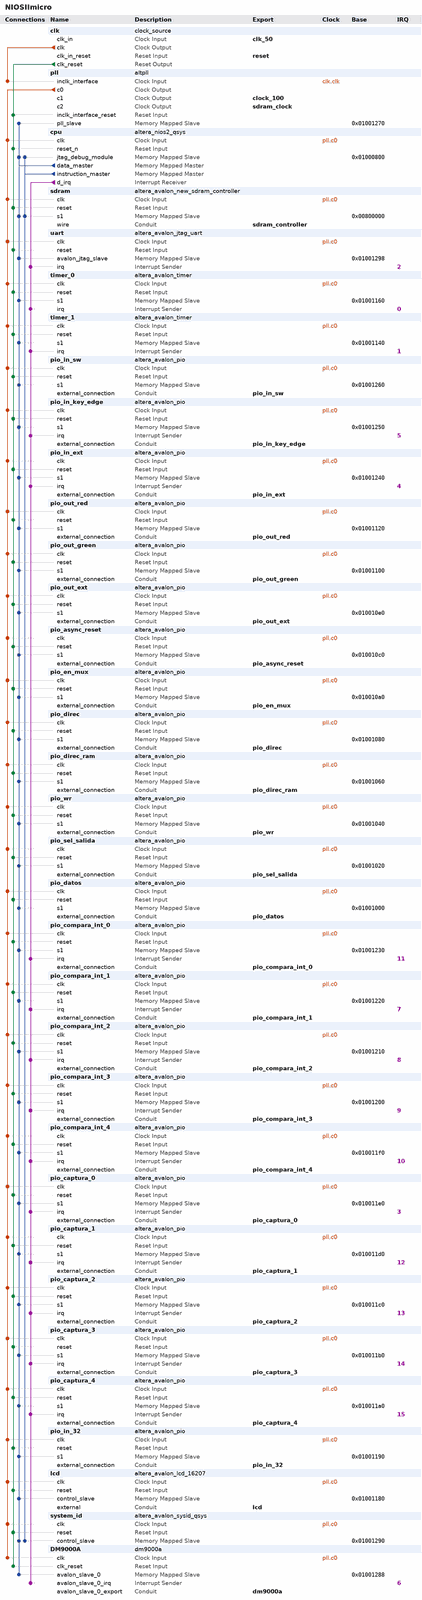
[diagram p0: system contents, whole]
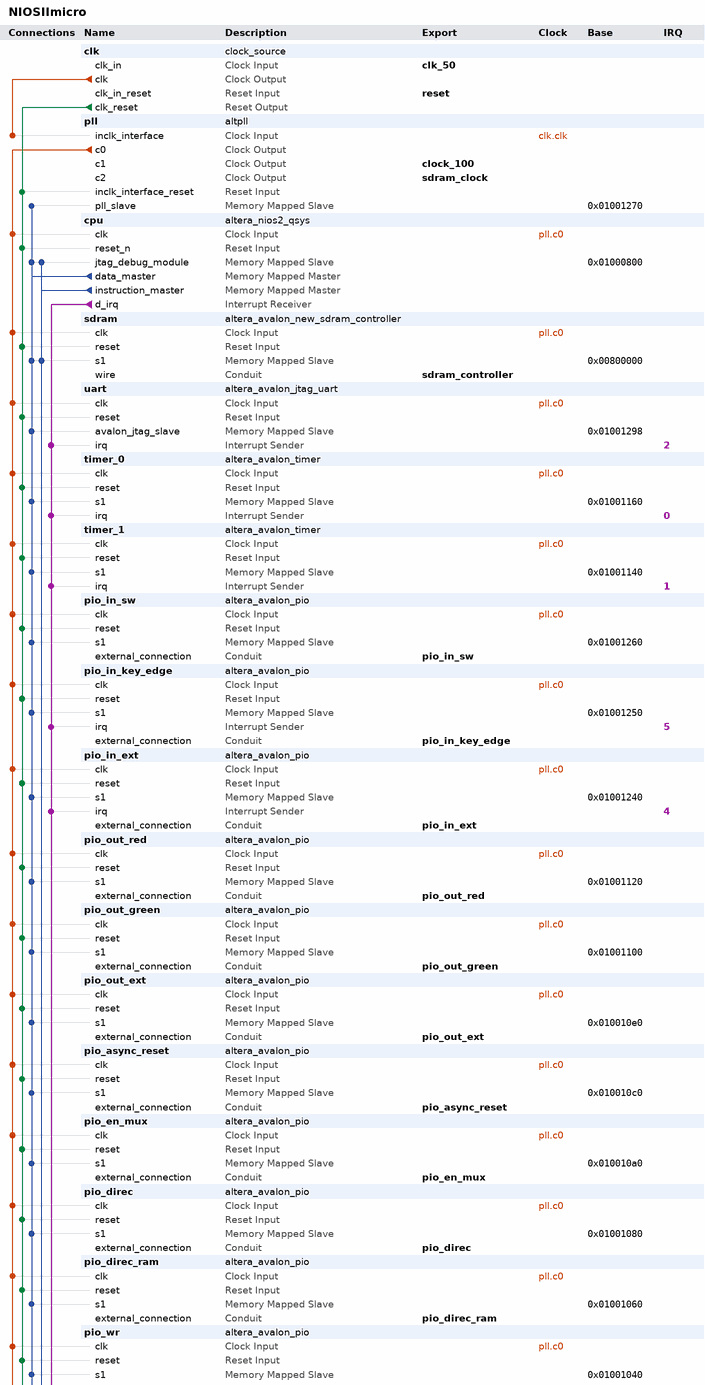
[diagram p1: system contents, upper part]
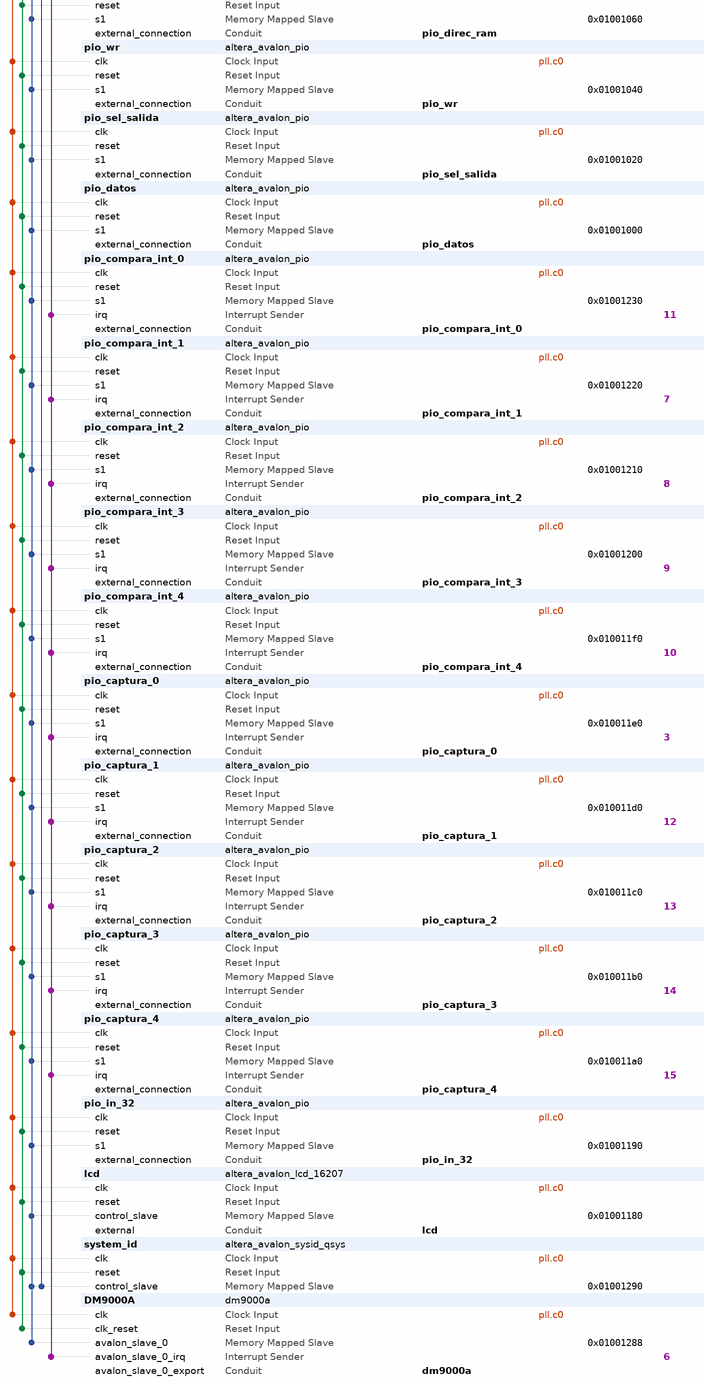
[diagram p2: system contents, lower part]
# Platform Designer (Qsys) system NIOSIImicro, Cyclone II EP2C35F672C6
# Parameters at their usual value, and those the tool derives, are not listed.
package require -exact qsys 13.0.1.99.2
create_system NIOSIImicro
set_project_property DEVICE_FAMILY {Cyclone II}
set_project_property DEVICE EP2C35F672C6

add_instance clk clock_source 13.0
set_instance_parameter_value clk clockFrequency 50000000

add_instance pll altpll 13.0
set_instance_parameter_value pll INCLK0_INPUT_FREQUENCY 20000
set_instance_parameter_value pll GATE_LOCK_SIGNAL NO
set_instance_parameter_value pll VALID_LOCK_MULTIPLIER 1
set_instance_parameter_value pll INVALID_LOCK_MULTIPLIER 5
set_instance_parameter_value pll CLK0_MULTIPLY_BY 1
set_instance_parameter_value pll CLK1_MULTIPLY_BY 2
set_instance_parameter_value pll CLK2_MULTIPLY_BY 1
set_instance_parameter_value pll CLK0_DIVIDE_BY 1
set_instance_parameter_value pll CLK1_DIVIDE_BY 1
set_instance_parameter_value pll CLK2_DIVIDE_BY 1
set_instance_parameter_value pll CLK1_PHASE_SHIFT 0
set_instance_parameter_value pll CLK2_PHASE_SHIFT -3000
set_instance_parameter_value pll CLK1_DUTY_CYCLE 50
set_instance_parameter_value pll CLK2_DUTY_CYCLE 50
set_instance_parameter_value pll PORT_clk1 PORT_USED
set_instance_parameter_value pll PORT_clk2 PORT_USED
set_instance_parameter_value pll PORT_clk3 PORT_UNUSED
set_instance_parameter_value pll PORT_ARESET PORT_UNUSED
set_instance_parameter_value pll PORT_LOCKED PORT_UNUSED

add_instance cpu altera_nios2_qsys 13.0
set_instance_parameter_value cpu manuallyAssignCpuID false
set_instance_parameter_value cpu resetSlave sdram.s1
set_instance_parameter_value cpu mmu_TLBMissExcSlave None
set_instance_parameter_value cpu exceptionSlave sdram.s1
set_instance_parameter_value cpu breakSlave cpu.jtag_debug_module
set_instance_parameter_value cpu impl Fast
set_instance_parameter_value cpu icache_size 4096
set_instance_parameter_value cpu dcache_lineSize 4

add_instance sdram altera_avalon_new_sdram_controller 13.0.1.99.2
set_instance_parameter_value sdram TAC 5.5
set_instance_parameter_value sdram TRCD 20.0
set_instance_parameter_value sdram TRP 20.0
set_instance_parameter_value sdram casLatency 3
set_instance_parameter_value sdram columnWidth 8
set_instance_parameter_value sdram dataWidth 16
set_instance_parameter_value sdram generateSimulationModel false
set_instance_parameter_value sdram model single_Micron_MT48LC4M32B2_7_chip
set_instance_parameter_value sdram numberOfBanks 4
set_instance_parameter_value sdram numberOfChipSelects 1
set_instance_parameter_value sdram powerUpDelay 100.0
set_instance_parameter_value sdram refreshPeriod 15.625
set_instance_parameter_value sdram rowWidth 12

add_instance uart altera_avalon_jtag_uart 13.0.1.99.2
set_instance_parameter_value uart simInteractiveOptions NO_INTERACTIVE_WINDOWS

add_instance timer_0 altera_avalon_timer 13.0.1.99.2
set_instance_parameter_value timer_0 period 100
set_instance_parameter_value timer_0 periodUnits USEC

add_instance timer_1 altera_avalon_timer 13.0.1.99.2
set_instance_parameter_value timer_1 period 1
set_instance_parameter_value timer_1 periodUnits MSEC

add_instance pio_in_sw altera_avalon_pio 13.0.1.99.2
set_instance_parameter_value pio_in_sw direction Input
set_instance_parameter_value pio_in_sw width 18

add_instance pio_in_key_edge altera_avalon_pio 13.0.1.99.2
set_instance_parameter_value pio_in_key_edge bitClearingEdgeCapReg true
set_instance_parameter_value pio_in_key_edge captureEdge true
set_instance_parameter_value pio_in_key_edge direction Input
set_instance_parameter_value pio_in_key_edge edgeType FALLING
set_instance_parameter_value pio_in_key_edge generateIRQ true
set_instance_parameter_value pio_in_key_edge irqType EDGE
set_instance_parameter_value pio_in_key_edge width 3

add_instance pio_in_ext altera_avalon_pio 13.0.1.99.2
set_instance_parameter_value pio_in_ext bitClearingEdgeCapReg true
set_instance_parameter_value pio_in_ext captureEdge true
set_instance_parameter_value pio_in_ext direction Input
set_instance_parameter_value pio_in_ext generateIRQ true
set_instance_parameter_value pio_in_ext irqType EDGE
set_instance_parameter_value pio_in_ext width 8

add_instance pio_out_red altera_avalon_pio 13.0.1.99.2
set_instance_parameter_value pio_out_red bitModifyingOutReg true
set_instance_parameter_value pio_out_red direction Output
set_instance_parameter_value pio_out_red width 18

add_instance pio_out_green altera_avalon_pio 13.0.1.99.2
set_instance_parameter_value pio_out_green bitModifyingOutReg true
set_instance_parameter_value pio_out_green direction Output
set_instance_parameter_value pio_out_green width 9

add_instance pio_out_ext altera_avalon_pio 13.0.1.99.2
set_instance_parameter_value pio_out_ext bitModifyingOutReg true
set_instance_parameter_value pio_out_ext direction Output
set_instance_parameter_value pio_out_ext width 8

add_instance pio_async_reset altera_avalon_pio 13.0.1.99.2
set_instance_parameter_value pio_async_reset bitModifyingOutReg true
set_instance_parameter_value pio_async_reset direction Output
set_instance_parameter_value pio_async_reset width 1

add_instance pio_en_mux altera_avalon_pio 13.0.1.99.2
set_instance_parameter_value pio_en_mux bitModifyingOutReg true
set_instance_parameter_value pio_en_mux direction Output
set_instance_parameter_value pio_en_mux width 1

add_instance pio_direc altera_avalon_pio 13.0.1.99.2
set_instance_parameter_value pio_direc bitModifyingOutReg true
set_instance_parameter_value pio_direc direction Output
set_instance_parameter_value pio_direc width 4

add_instance pio_direc_ram altera_avalon_pio 13.0.1.99.2
set_instance_parameter_value pio_direc_ram bitModifyingOutReg true
set_instance_parameter_value pio_direc_ram direction Output
set_instance_parameter_value pio_direc_ram width 6

add_instance pio_wr altera_avalon_pio 13.0.1.99.2
set_instance_parameter_value pio_wr bitModifyingOutReg true
set_instance_parameter_value pio_wr direction Output
set_instance_parameter_value pio_wr width 1

add_instance pio_sel_salida altera_avalon_pio 13.0.1.99.2
set_instance_parameter_value pio_sel_salida bitModifyingOutReg true
set_instance_parameter_value pio_sel_salida direction Output
set_instance_parameter_value pio_sel_salida width 4

add_instance pio_datos altera_avalon_pio 13.0.1.99.2
set_instance_parameter_value pio_datos bitModifyingOutReg true
set_instance_parameter_value pio_datos direction Output
set_instance_parameter_value pio_datos width 32

add_instance pio_compara_int_0 altera_avalon_pio 13.0.1.99.2
set_instance_parameter_value pio_compara_int_0 bitClearingEdgeCapReg true
set_instance_parameter_value pio_compara_int_0 captureEdge true
set_instance_parameter_value pio_compara_int_0 direction Input
set_instance_parameter_value pio_compara_int_0 generateIRQ true
set_instance_parameter_value pio_compara_int_0 irqType EDGE
set_instance_parameter_value pio_compara_int_0 width 1

add_instance pio_compara_int_1 altera_avalon_pio 13.0.1.99.2
set_instance_parameter_value pio_compara_int_1 bitClearingEdgeCapReg true
set_instance_parameter_value pio_compara_int_1 captureEdge true
set_instance_parameter_value pio_compara_int_1 direction Input
set_instance_parameter_value pio_compara_int_1 generateIRQ true
set_instance_parameter_value pio_compara_int_1 irqType EDGE
set_instance_parameter_value pio_compara_int_1 width 1

add_instance pio_compara_int_2 altera_avalon_pio 13.0.1.99.2
set_instance_parameter_value pio_compara_int_2 bitClearingEdgeCapReg true
set_instance_parameter_value pio_compara_int_2 captureEdge true
set_instance_parameter_value pio_compara_int_2 direction Input
set_instance_parameter_value pio_compara_int_2 generateIRQ true
set_instance_parameter_value pio_compara_int_2 irqType EDGE
set_instance_parameter_value pio_compara_int_2 width 1

add_instance pio_compara_int_3 altera_avalon_pio 13.0.1.99.2
set_instance_parameter_value pio_compara_int_3 bitClearingEdgeCapReg true
set_instance_parameter_value pio_compara_int_3 captureEdge true
set_instance_parameter_value pio_compara_int_3 direction Input
set_instance_parameter_value pio_compara_int_3 generateIRQ true
set_instance_parameter_value pio_compara_int_3 irqType EDGE
set_instance_parameter_value pio_compara_int_3 width 1

add_instance pio_compara_int_4 altera_avalon_pio 13.0.1.99.2
set_instance_parameter_value pio_compara_int_4 bitClearingEdgeCapReg true
set_instance_parameter_value pio_compara_int_4 captureEdge true
set_instance_parameter_value pio_compara_int_4 direction Input
set_instance_parameter_value pio_compara_int_4 generateIRQ true
set_instance_parameter_value pio_compara_int_4 irqType EDGE
set_instance_parameter_value pio_compara_int_4 width 1

add_instance pio_captura_0 altera_avalon_pio 13.0.1.99.2
set_instance_parameter_value pio_captura_0 bitClearingEdgeCapReg true
set_instance_parameter_value pio_captura_0 captureEdge true
set_instance_parameter_value pio_captura_0 direction Input
set_instance_parameter_value pio_captura_0 generateIRQ true
set_instance_parameter_value pio_captura_0 irqType EDGE
set_instance_parameter_value pio_captura_0 width 1

add_instance pio_captura_1 altera_avalon_pio 13.0.1.99.2
set_instance_parameter_value pio_captura_1 bitClearingEdgeCapReg true
set_instance_parameter_value pio_captura_1 captureEdge true
set_instance_parameter_value pio_captura_1 direction Input
set_instance_parameter_value pio_captura_1 generateIRQ true
set_instance_parameter_value pio_captura_1 irqType EDGE
set_instance_parameter_value pio_captura_1 width 1

add_instance pio_captura_2 altera_avalon_pio 13.0.1.99.2
set_instance_parameter_value pio_captura_2 bitClearingEdgeCapReg true
set_instance_parameter_value pio_captura_2 captureEdge true
set_instance_parameter_value pio_captura_2 direction Input
set_instance_parameter_value pio_captura_2 generateIRQ true
set_instance_parameter_value pio_captura_2 irqType EDGE
set_instance_parameter_value pio_captura_2 width 1

add_instance pio_captura_3 altera_avalon_pio 13.0.1.99.2
set_instance_parameter_value pio_captura_3 bitClearingEdgeCapReg true
set_instance_parameter_value pio_captura_3 captureEdge true
set_instance_parameter_value pio_captura_3 direction Input
set_instance_parameter_value pio_captura_3 generateIRQ true
set_instance_parameter_value pio_captura_3 irqType EDGE
set_instance_parameter_value pio_captura_3 width 1

add_instance pio_captura_4 altera_avalon_pio 13.0.1.99.2
set_instance_parameter_value pio_captura_4 bitClearingEdgeCapReg true
set_instance_parameter_value pio_captura_4 captureEdge true
set_instance_parameter_value pio_captura_4 direction Input
set_instance_parameter_value pio_captura_4 generateIRQ true
set_instance_parameter_value pio_captura_4 irqType EDGE
set_instance_parameter_value pio_captura_4 width 1

add_instance pio_in_32 altera_avalon_pio 13.0.1.99.2
set_instance_parameter_value pio_in_32 bitClearingEdgeCapReg true
set_instance_parameter_value pio_in_32 captureEdge true
set_instance_parameter_value pio_in_32 direction Input
set_instance_parameter_value pio_in_32 width 32

add_instance lcd altera_avalon_lcd_16207 13.0.1.99.2

add_instance system_id altera_avalon_sysid_qsys 13.0
set_instance_parameter_value system_id id 305419896

add_instance DM9000A dm9000a 1.0.1

# connections
add_connection clk.clk pll.inclk_interface clock
add_connection pll.c0 cpu.clk clock
add_connection pll.c0 DM9000A.clk clock
add_connection pll.c0 lcd.clk clock
add_connection pll.c0 pio_async_reset.clk clock
add_connection pll.c0 pio_captura_0.clk clock
add_connection pll.c0 pio_captura_1.clk clock
add_connection pll.c0 pio_captura_2.clk clock
add_connection pll.c0 pio_captura_3.clk clock
add_connection pll.c0 pio_captura_4.clk clock
add_connection pll.c0 pio_compara_int_0.clk clock
add_connection pll.c0 pio_compara_int_1.clk clock
add_connection pll.c0 pio_compara_int_2.clk clock
add_connection pll.c0 pio_compara_int_3.clk clock
add_connection pll.c0 pio_compara_int_4.clk clock
add_connection pll.c0 pio_datos.clk clock
add_connection pll.c0 pio_direc.clk clock
add_connection pll.c0 pio_direc_ram.clk clock
add_connection pll.c0 pio_en_mux.clk clock
add_connection pll.c0 pio_in_32.clk clock
add_connection pll.c0 pio_in_ext.clk clock
add_connection pll.c0 pio_in_key_edge.clk clock
add_connection pll.c0 pio_in_sw.clk clock
add_connection pll.c0 pio_out_ext.clk clock
add_connection pll.c0 pio_out_green.clk clock
add_connection pll.c0 pio_out_red.clk clock
add_connection pll.c0 pio_sel_salida.clk clock
add_connection pll.c0 pio_wr.clk clock
add_connection pll.c0 sdram.clk clock
add_connection pll.c0 system_id.clk clock
add_connection pll.c0 timer_0.clk clock
add_connection pll.c0 timer_1.clk clock
add_connection pll.c0 uart.clk clock
add_connection clk.clk_reset cpu.reset_n reset
add_connection clk.clk_reset DM9000A.clk_reset reset
add_connection clk.clk_reset lcd.reset reset
add_connection clk.clk_reset pio_async_reset.reset reset
add_connection clk.clk_reset pio_captura_0.reset reset
add_connection clk.clk_reset pio_captura_1.reset reset
add_connection clk.clk_reset pio_captura_2.reset reset
add_connection clk.clk_reset pio_captura_3.reset reset
add_connection clk.clk_reset pio_captura_4.reset reset
add_connection clk.clk_reset pio_compara_int_0.reset reset
add_connection clk.clk_reset pio_compara_int_1.reset reset
add_connection clk.clk_reset pio_compara_int_2.reset reset
add_connection clk.clk_reset pio_compara_int_3.reset reset
add_connection clk.clk_reset pio_compara_int_4.reset reset
add_connection clk.clk_reset pio_datos.reset reset
add_connection clk.clk_reset pio_direc.reset reset
add_connection clk.clk_reset pio_direc_ram.reset reset
add_connection clk.clk_reset pio_en_mux.reset reset
add_connection clk.clk_reset pio_in_32.reset reset
add_connection clk.clk_reset pio_in_ext.reset reset
add_connection clk.clk_reset pio_in_key_edge.reset reset
add_connection clk.clk_reset pio_in_sw.reset reset
add_connection clk.clk_reset pio_out_ext.reset reset
add_connection clk.clk_reset pio_out_green.reset reset
add_connection clk.clk_reset pio_out_red.reset reset
add_connection clk.clk_reset pio_sel_salida.reset reset
add_connection clk.clk_reset pio_wr.reset reset
add_connection clk.clk_reset pll.inclk_interface_reset reset
add_connection clk.clk_reset sdram.reset reset
add_connection clk.clk_reset system_id.reset reset
add_connection clk.clk_reset timer_0.reset reset
add_connection clk.clk_reset timer_1.reset reset
add_connection clk.clk_reset uart.reset reset
add_connection cpu.data_master cpu.jtag_debug_module avalon
set_connection_parameter_value cpu.data_master/cpu.jtag_debug_module baseAddress 0x01000800
add_connection cpu.data_master DM9000A.avalon_slave_0 avalon
set_connection_parameter_value cpu.data_master/DM9000A.avalon_slave_0 baseAddress 0x01001288
add_connection cpu.data_master lcd.control_slave avalon
set_connection_parameter_value cpu.data_master/lcd.control_slave baseAddress 0x01001180
add_connection cpu.data_master pio_async_reset.s1 avalon
set_connection_parameter_value cpu.data_master/pio_async_reset.s1 baseAddress 0x010010c0
add_connection cpu.data_master pio_captura_0.s1 avalon
set_connection_parameter_value cpu.data_master/pio_captura_0.s1 baseAddress 0x010011e0
add_connection cpu.data_master pio_captura_1.s1 avalon
set_connection_parameter_value cpu.data_master/pio_captura_1.s1 baseAddress 0x010011d0
add_connection cpu.data_master pio_captura_2.s1 avalon
set_connection_parameter_value cpu.data_master/pio_captura_2.s1 baseAddress 0x010011c0
add_connection cpu.data_master pio_captura_3.s1 avalon
set_connection_parameter_value cpu.data_master/pio_captura_3.s1 baseAddress 0x010011b0
add_connection cpu.data_master pio_captura_4.s1 avalon
set_connection_parameter_value cpu.data_master/pio_captura_4.s1 baseAddress 0x010011a0
add_connection cpu.data_master pio_compara_int_0.s1 avalon
set_connection_parameter_value cpu.data_master/pio_compara_int_0.s1 baseAddress 0x01001230
add_connection cpu.data_master pio_compara_int_1.s1 avalon
set_connection_parameter_value cpu.data_master/pio_compara_int_1.s1 baseAddress 0x01001220
add_connection cpu.data_master pio_compara_int_2.s1 avalon
set_connection_parameter_value cpu.data_master/pio_compara_int_2.s1 baseAddress 0x01001210
add_connection cpu.data_master pio_compara_int_3.s1 avalon
set_connection_parameter_value cpu.data_master/pio_compara_int_3.s1 baseAddress 0x01001200
add_connection cpu.data_master pio_compara_int_4.s1 avalon
set_connection_parameter_value cpu.data_master/pio_compara_int_4.s1 baseAddress 0x010011f0
add_connection cpu.data_master pio_datos.s1 avalon
set_connection_parameter_value cpu.data_master/pio_datos.s1 baseAddress 0x01001000
add_connection cpu.data_master pio_direc.s1 avalon
set_connection_parameter_value cpu.data_master/pio_direc.s1 baseAddress 0x01001080
add_connection cpu.data_master pio_direc_ram.s1 avalon
set_connection_parameter_value cpu.data_master/pio_direc_ram.s1 baseAddress 0x01001060
add_connection cpu.data_master pio_en_mux.s1 avalon
set_connection_parameter_value cpu.data_master/pio_en_mux.s1 baseAddress 0x010010a0
add_connection cpu.data_master pio_in_32.s1 avalon
set_connection_parameter_value cpu.data_master/pio_in_32.s1 baseAddress 0x01001190
add_connection cpu.data_master pio_in_ext.s1 avalon
set_connection_parameter_value cpu.data_master/pio_in_ext.s1 baseAddress 0x01001240
add_connection cpu.data_master pio_in_key_edge.s1 avalon
set_connection_parameter_value cpu.data_master/pio_in_key_edge.s1 baseAddress 0x01001250
add_connection cpu.data_master pio_in_sw.s1 avalon
set_connection_parameter_value cpu.data_master/pio_in_sw.s1 baseAddress 0x01001260
add_connection cpu.data_master pio_out_ext.s1 avalon
set_connection_parameter_value cpu.data_master/pio_out_ext.s1 baseAddress 0x010010e0
add_connection cpu.data_master pio_out_green.s1 avalon
set_connection_parameter_value cpu.data_master/pio_out_green.s1 baseAddress 0x01001100
add_connection cpu.data_master pio_out_red.s1 avalon
set_connection_parameter_value cpu.data_master/pio_out_red.s1 baseAddress 0x01001120
add_connection cpu.data_master pio_sel_salida.s1 avalon
set_connection_parameter_value cpu.data_master/pio_sel_salida.s1 baseAddress 0x01001020
add_connection cpu.data_master pio_wr.s1 avalon
set_connection_parameter_value cpu.data_master/pio_wr.s1 baseAddress 0x01001040
add_connection cpu.data_master pll.pll_slave avalon
set_connection_parameter_value cpu.data_master/pll.pll_slave baseAddress 0x01001270
add_connection cpu.data_master sdram.s1 avalon
set_connection_parameter_value cpu.data_master/sdram.s1 baseAddress 0x00800000
add_connection cpu.data_master system_id.control_slave avalon
set_connection_parameter_value cpu.data_master/system_id.control_slave baseAddress 0x01001290
add_connection cpu.data_master timer_0.s1 avalon
set_connection_parameter_value cpu.data_master/timer_0.s1 baseAddress 0x01001160
add_connection cpu.data_master timer_1.s1 avalon
set_connection_parameter_value cpu.data_master/timer_1.s1 baseAddress 0x01001140
add_connection cpu.data_master uart.avalon_jtag_slave avalon
set_connection_parameter_value cpu.data_master/uart.avalon_jtag_slave baseAddress 0x01001298
add_connection cpu.instruction_master cpu.jtag_debug_module avalon
set_connection_parameter_value cpu.instruction_master/cpu.jtag_debug_module baseAddress 0x01000800
add_connection cpu.instruction_master sdram.s1 avalon
set_connection_parameter_value cpu.instruction_master/sdram.s1 baseAddress 0x00800000
add_connection cpu.instruction_master system_id.control_slave avalon
set_connection_parameter_value cpu.instruction_master/system_id.control_slave baseAddress 0x01001290
add_connection cpu.d_irq DM9000A.avalon_slave_0_irq interrupt
set_connection_parameter_value cpu.d_irq/DM9000A.avalon_slave_0_irq irqNumber 6
add_connection cpu.d_irq pio_captura_0.irq interrupt
set_connection_parameter_value cpu.d_irq/pio_captura_0.irq irqNumber 3
add_connection cpu.d_irq pio_captura_1.irq interrupt
set_connection_parameter_value cpu.d_irq/pio_captura_1.irq irqNumber 12
add_connection cpu.d_irq pio_captura_2.irq interrupt
set_connection_parameter_value cpu.d_irq/pio_captura_2.irq irqNumber 13
add_connection cpu.d_irq pio_captura_3.irq interrupt
set_connection_parameter_value cpu.d_irq/pio_captura_3.irq irqNumber 14
add_connection cpu.d_irq pio_captura_4.irq interrupt
set_connection_parameter_value cpu.d_irq/pio_captura_4.irq irqNumber 15
add_connection cpu.d_irq pio_compara_int_0.irq interrupt
set_connection_parameter_value cpu.d_irq/pio_compara_int_0.irq irqNumber 11
add_connection cpu.d_irq pio_compara_int_1.irq interrupt
set_connection_parameter_value cpu.d_irq/pio_compara_int_1.irq irqNumber 7
add_connection cpu.d_irq pio_compara_int_2.irq interrupt
set_connection_parameter_value cpu.d_irq/pio_compara_int_2.irq irqNumber 8
add_connection cpu.d_irq pio_compara_int_3.irq interrupt
set_connection_parameter_value cpu.d_irq/pio_compara_int_3.irq irqNumber 9
add_connection cpu.d_irq pio_compara_int_4.irq interrupt
set_connection_parameter_value cpu.d_irq/pio_compara_int_4.irq irqNumber 10
add_connection cpu.d_irq pio_in_ext.irq interrupt
set_connection_parameter_value cpu.d_irq/pio_in_ext.irq irqNumber 4
add_connection cpu.d_irq pio_in_key_edge.irq interrupt
set_connection_parameter_value cpu.d_irq/pio_in_key_edge.irq irqNumber 5
add_connection cpu.d_irq timer_0.irq interrupt
set_connection_parameter_value cpu.d_irq/timer_0.irq irqNumber 0
add_connection cpu.d_irq timer_1.irq interrupt
set_connection_parameter_value cpu.d_irq/timer_1.irq irqNumber 1
add_connection cpu.d_irq uart.irq interrupt
set_connection_parameter_value cpu.d_irq/uart.irq irqNumber 2

# exported interfaces
add_interface clk_50 clock sink
set_interface_property clk_50 EXPORT_OF clk.clk_in
add_interface sdram_controller conduit end
set_interface_property sdram_controller EXPORT_OF sdram.wire
add_interface pio_in_sw conduit end
set_interface_property pio_in_sw EXPORT_OF pio_in_sw.external_connection
add_interface pio_in_key_edge conduit end
set_interface_property pio_in_key_edge EXPORT_OF pio_in_key_edge.external_connection
add_interface pio_in_ext conduit end
set_interface_property pio_in_ext EXPORT_OF pio_in_ext.external_connection
add_interface pio_out_red conduit end
set_interface_property pio_out_red EXPORT_OF pio_out_red.external_connection
add_interface pio_out_green conduit end
set_interface_property pio_out_green EXPORT_OF pio_out_green.external_connection
add_interface pio_out_ext conduit end
set_interface_property pio_out_ext EXPORT_OF pio_out_ext.external_connection
add_interface pio_en_mux conduit end
set_interface_property pio_en_mux EXPORT_OF pio_en_mux.external_connection
add_interface pio_direc conduit end
set_interface_property pio_direc EXPORT_OF pio_direc.external_connection
add_interface pio_direc_ram conduit end
set_interface_property pio_direc_ram EXPORT_OF pio_direc_ram.external_connection
add_interface pio_wr conduit end
set_interface_property pio_wr EXPORT_OF pio_wr.external_connection
add_interface pio_sel_salida conduit end
set_interface_property pio_sel_salida EXPORT_OF pio_sel_salida.external_connection
add_interface pio_datos conduit end
set_interface_property pio_datos EXPORT_OF pio_datos.external_connection
add_interface pio_compara_int_0 conduit end
set_interface_property pio_compara_int_0 EXPORT_OF pio_compara_int_0.external_connection
add_interface pio_compara_int_1 conduit end
set_interface_property pio_compara_int_1 EXPORT_OF pio_compara_int_1.external_connection
add_interface pio_compara_int_2 conduit end
set_interface_property pio_compara_int_2 EXPORT_OF pio_compara_int_2.external_connection
add_interface pio_compara_int_3 conduit end
set_interface_property pio_compara_int_3 EXPORT_OF pio_compara_int_3.external_connection
add_interface pio_compara_int_4 conduit end
set_interface_property pio_compara_int_4 EXPORT_OF pio_compara_int_4.external_connection
add_interface pio_captura_0 conduit end
set_interface_property pio_captura_0 EXPORT_OF pio_captura_0.external_connection
add_interface pio_captura_1 conduit end
set_interface_property pio_captura_1 EXPORT_OF pio_captura_1.external_connection
add_interface pio_captura_2 conduit end
set_interface_property pio_captura_2 EXPORT_OF pio_captura_2.external_connection
add_interface pio_captura_3 conduit end
set_interface_property pio_captura_3 EXPORT_OF pio_captura_3.external_connection
add_interface pio_captura_4 conduit end
set_interface_property pio_captura_4 EXPORT_OF pio_captura_4.external_connection
add_interface pio_in_32 conduit end
set_interface_property pio_in_32 EXPORT_OF pio_in_32.external_connection
add_interface lcd conduit end
set_interface_property lcd EXPORT_OF lcd.external
add_interface dm9000a conduit end
set_interface_property dm9000a EXPORT_OF DM9000A.avalon_slave_0_export
add_interface pio_async_reset conduit end
set_interface_property pio_async_reset EXPORT_OF pio_async_reset.external_connection
add_interface reset reset sink
set_interface_property reset EXPORT_OF clk.clk_in_reset
add_interface clock_100 clock source
set_interface_property clock_100 EXPORT_OF pll.c1
add_interface sdram_clock clock source
set_interface_property sdram_clock EXPORT_OF pll.c2

set_interconnect_requirement {$system} qsys_mm.clockCrossingAdapter HANDSHAKE
set_interconnect_requirement {$system} qsys_mm.maxAdditionalLatency 0

save_system NIOSIImicro.qsys
